# EAGLE board ver5b (EAGLE 6.4), part 1 of 3
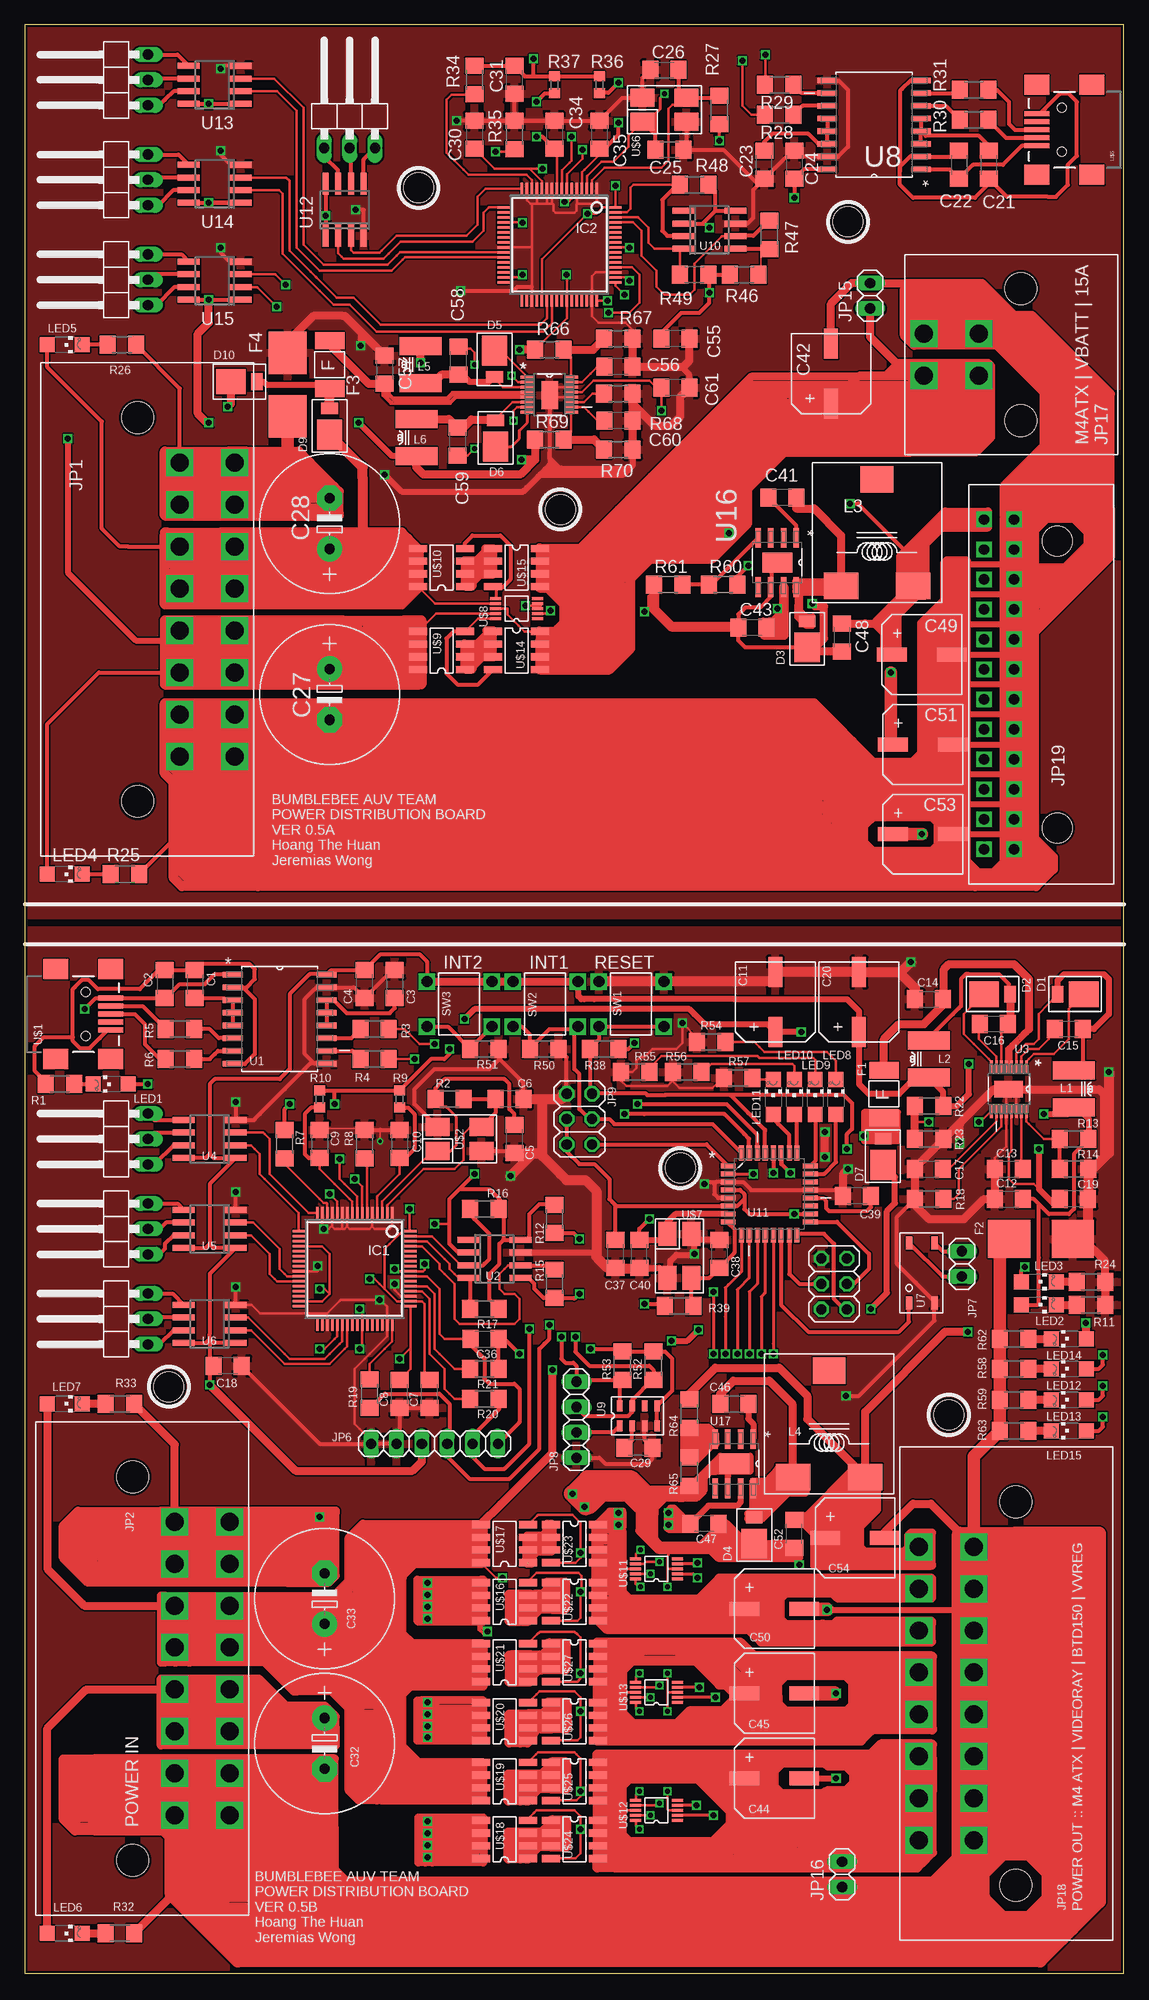
[diagram p7: board, top side]
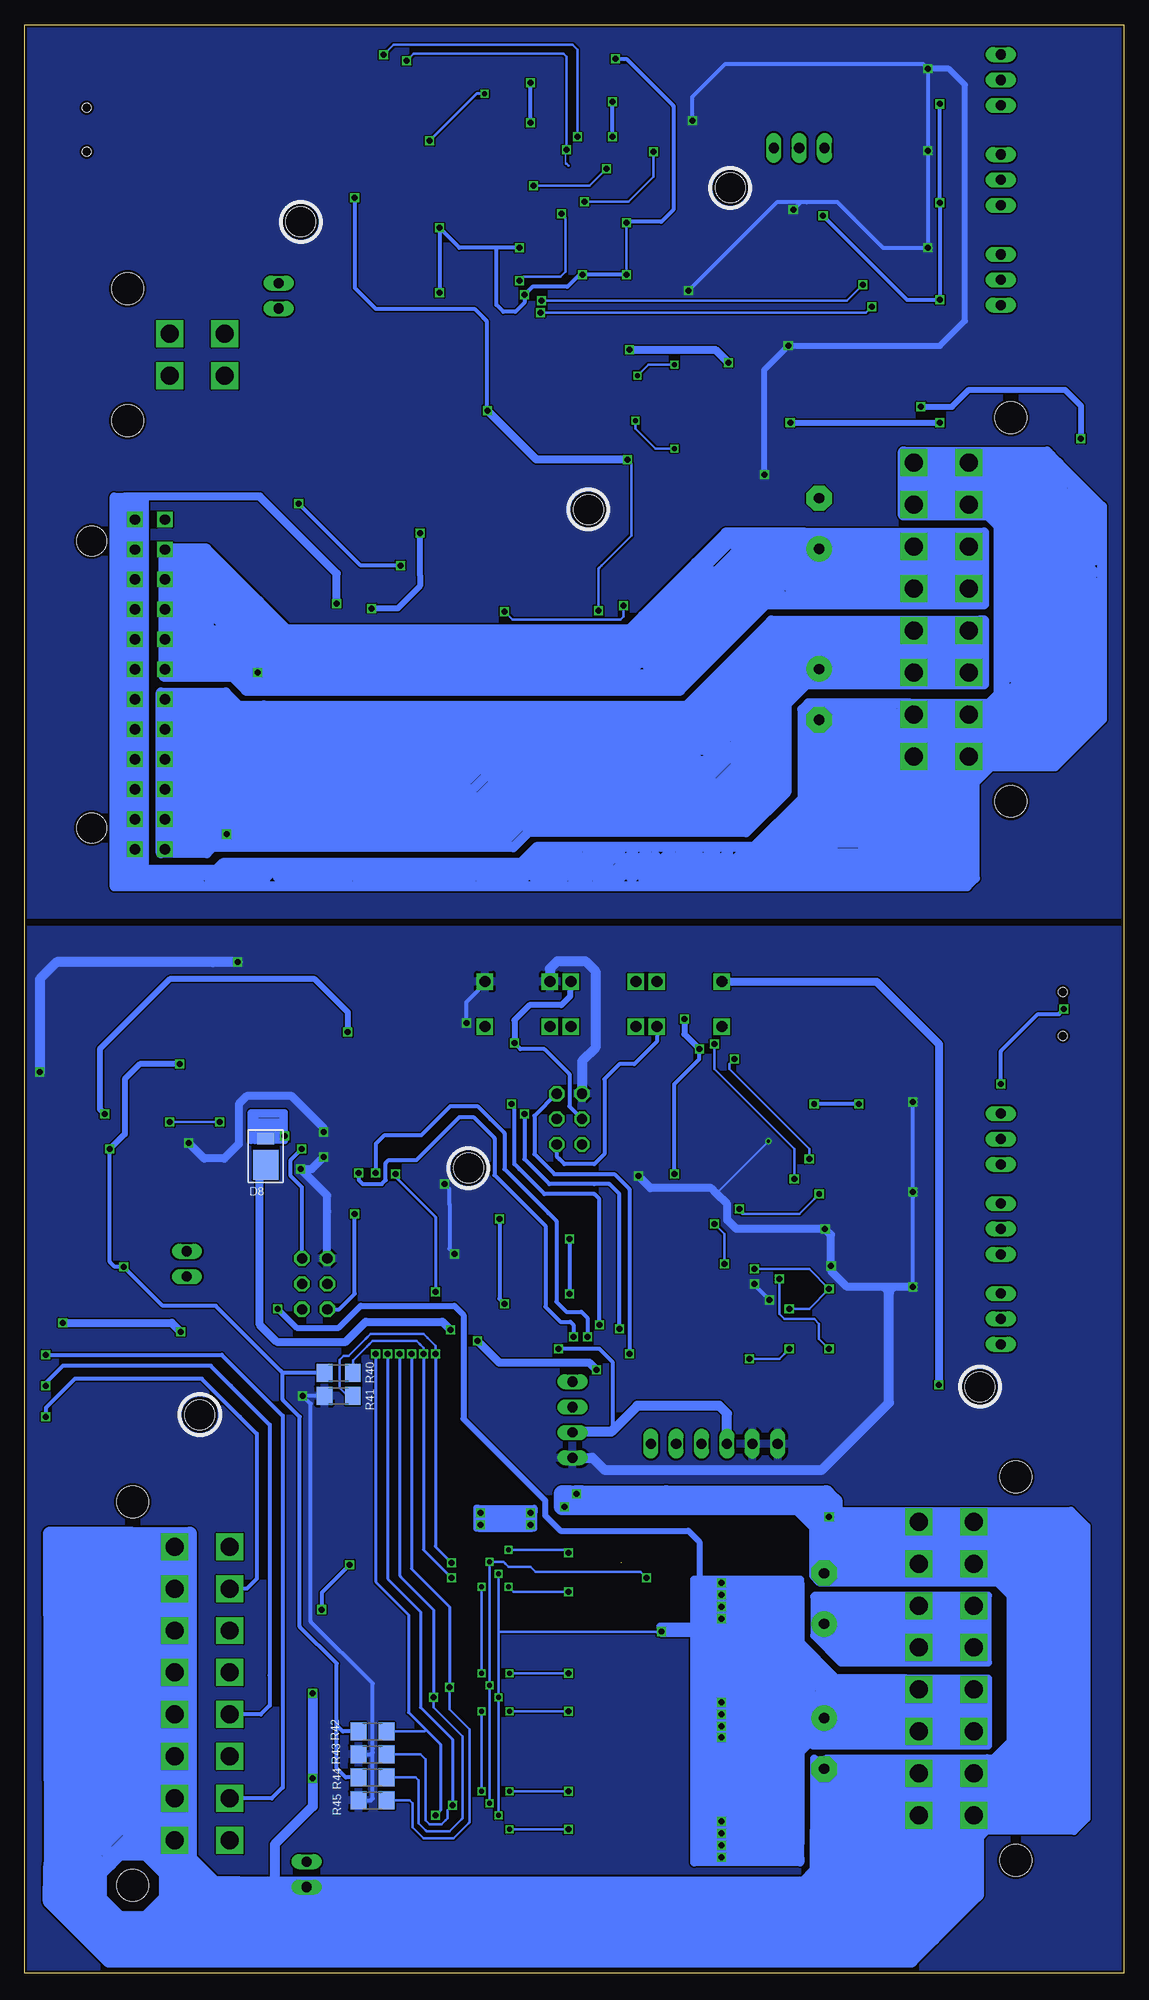
[diagram p8: board, bottom side, seen from below]

Size 110 x 195 mm. Coordinates in mm from the lower left corner, seen from the top.
Outline: 0,0 110,0 110,195 0,195 0,0
Copper layers (1*2*15*16): Top 0.035mm / dielectric 0.2mm / Route2 0.0175mm / dielectric 1.1mm / Route15 0.0175mm / dielectric 0.2mm / Bottom 0.035mm
Design rules "SeeedStudio_DRU_no_angle_20130527": minimum track width 6mil, minimum drill 12mil, track to track 6mil, track to pad 6mil, pad to pad 6mil, via to via 6mil, smd to smd 0mil, copper to edge 10mil, drill to drill 10mil, minimum pad ring 6mil, minimum via ring 6mil, stop-mask expansion 2mil, vias tented up to drill 25mil, thermal gap 10mil
Net classes: 0 default: clearance 0.152 mm
Holes 3 mm at 14.4,58.7 65.6,80.6 92.5,55.9 82.4,175.3 39.4,178.7 53.6,146.5

## Footprints (pad centres in the part's own frame; a part is rotated, then mirrored left to right if it is on the bottom)
C1206 = smd 1.6 x 1.8: 1 -1.4,0; 2 1.4,0
EEEFTH101XAP = smd 3 x 1.4: P$1 -1,0; P$2 5,0
E5-13 = drill 1.016 pad 2.54: + -2.54,0 | drill 1.016 pad 2.54 octagon: - 2.54,0
MBRM140T3G-1459068RL = smd 2.97 x 2.54: 1 0,0 | smd 1.162 x 1.67: 2 2.631,0
MF-MSMF050-2 = smd 1.68 x 2.95: P$1 -2.39,0; P$2 2.39,0
0154.500DR-FUSE-0453.500 = smd 4.24 x 3.81: P$1 -3.19,0; P$2 3.19,0
LQFP64 = smd 0.25 x 1.2: 1 -3.75,-5.6; 2 -3.25,-5.6; 3 -2.75,-5.6; 4 -2.25,-5.6; 5 -1.75,-5.6; 6 -1.25,-5.6; 7 -0.75,-5.6; 8 -0.25,-5.6; 9 0.25,-5.6; 10 0.75,-5.6; 11 1.25,-5.6; 12 1.75,-5.6; 13 2.25,-5.6; 14 2.75,-5.6; 15 3.25,-5.6; 16 3.75,-5.6; 33 3.75,5.6; 34 3.25,5.6; 35 2.75,5.6; 36 2.25,5.6; 37 1.75,5.6; 38 1.25,5.6; 39 0.75,5.6; 40 0.25,5.6; 41 -0.25,5.6; 42 -0.75,5.6; 43 -1.25,5.6; 44 -1.75,5.6; 45 -2.25,5.6; 46 -2.75,5.6; 47 -3.25,5.6; 48 -3.75,5.6 | smd 1.2 x 0.25: 17 5.6,-3.75; 18 5.6,-3.25; 19 5.6,-2.75; 20 5.6,-2.25; 21 5.6,-1.75; 22 5.6,-1.25; 23 5.6,-0.75; 24 5.6,-0.25; 25 5.6,0.25; 26 5.6,0.75; 27 5.6,1.25; 28 5.6,1.75; 29 5.6,2.25; 30 5.6,2.75; 31 5.6,3.25; 32 5.6,3.75; 49 -5.6,3.75; 50 -5.6,3.25; 51 -5.6,2.75; 52 -5.6,2.25; 53 -5.6,1.75; 54 -5.6,1.25; 55 -5.6,0.75; 56 -5.6,0.25; 57 -5.6,-0.25; 58 -5.6,-0.75; 59 -5.6,-1.25; 60 -5.6,-1.75; 61 -5.6,-2.25; 62 -5.6,-2.75; 63 -5.6,-3.25; 64 -5.6,-3.75
39-29-1167-MOLEX = drill 1.8 square: P$1 -14.7,5.5; P$2 -14.7,0; P$3 -10.5,5.5; P$4 -10.5,0; P$5 -6.3,5.5; P$6 -6.3,0; P$7 -2.1,5.5; P$8 -2.1,0; P$9 2.1,5.5; P$10 2.1,0; P$11 6.3,5.5; P$12 6.3,0; P$13 10.5,5.5; P$14 10.5,0; P$15 14.7,5.5; P$16 14.7,0 | hole 3.2: -19.2,-4.2; 19.2,-4.2
1X03/90 = drill 1.016 long: 1 -2.54,-3.81; 2 0,-3.81; 3 2.54,-3.81
1X06 = drill 1.016 long: 1 -6.35,0; 2 -3.81,0; 3 -1.27,0; 4 1.27,0; 5 3.81,0; 6 6.35,0
1X02 = drill 1.016 long: 1 -1.27,0; 2 1.27,0
1X04 = drill 1.016 long: 1 -3.81,0; 2 -1.27,0; 3 1.27,0; 4 3.81,0
2X03 = drill 1.016 octagon: 1 -2.54,-1.27; 2 -2.54,1.27; 3 0,-1.27; 4 0,1.27; 5 2.54,-1.27; 6 2.54,1.27
39-29-4049-MOLEX = drill 1.8 square: P$1 -2.1,5.5; P$2 -2.1,0; P$3 2.1,5.5; P$4 2.1,0 | hole 3.2: -6.6,-4.2; 6.6,-4.2
43045-2400 = drill 1.03 square: 1 0,0; 2 0,3; 3 -3,0; 4 -3,3; 5 -6,0; 6 -6,3; 7 -9,0; 8 -9,3; 9 -12,0; 10 -12,3; 11 -15,0; 12 -15,3; 13 -18,0; 14 -18,3; 15 -21,0; 16 -21,3; 17 -24,0; 18 -24,3; 19 -27,0; 20 -27,3; 21 -30,0; 22 -30,3; 23 -33,0; 24 -33,3 | hole 3: -2.16,-4.32; -30.86,-4.32
LAIRD-TECH-INDUCTOR-TYS5040 = smd 1.8 x 4.2: 1 -1.85,0; 2 1.85,0
SER1360-802KLD-2288814RL-INDUCTOR = smd 2.66 x 3.47: 1 -5.32,3.605; 2 -5.32,-3.605 | smd 2.66 x 3.3: 3 5.32,0
CHIPLED_1206 = smd 1.5 x 1.5: A 0,-1.75; C 0,1.75
R1206 = smd 1.6 x 1.803: 1 -1.422,0; 2 1.422,0
R0603 = smd 1 x 1.1: 1 -0.85,0; 2 0.85,0
MC32829 = drill 1.1 square: P$1 -3.25,-2.25; P$2 -3.25,2.25; P$3 3.25,2.25; P$4 3.25,-2.25
SOIC127P1032X265-16N = smd 1.981 x 0.559: 1 -4.699,4.445; 2 -4.699,3.175; 3 -4.699,1.905; 4 -4.699,0.635; 5 -4.699,-0.635; 6 -4.699,-1.905; 7 -4.699,-3.175; 8 -4.699,-4.445; 9 4.699,-4.445; 10 4.699,-3.175; 11 4.699,-1.905; 12 4.699,-0.635; 13 4.699,0.635; 14 4.699,1.905; 15 4.699,3.175; 16 4.699,4.445
SO08 = smd 0.6 x 2.2: 1 -1.905,-2.6; 2 -0.635,-2.6; 3 0.635,-2.6; 4 1.905,-2.6; 5 1.905,2.6; 6 0.635,2.6; 7 -0.635,2.6; 8 -1.905,2.6
SOP50P490X110-17N = smd 1.397 x 0.279: 1 -2.184,1.753; 2 -2.184,1.245; 3 -2.184,0.762; 4 -2.184,0.254; 5 -2.184,-0.254; 6 -2.184,-0.762; 7 -2.184,-1.245; 8 -2.184,-1.753; 9 2.184,-1.753; 10 2.184,-1.245; 11 2.184,-0.762; 12 2.184,-0.254; 13 2.184,0.254; 14 2.184,0.762; 15 2.184,1.245; 16 2.184,1.753 | smd 1.651 x 2.845: 17 0.025,-0.051
PS2701A-1-F3-A-1682859RL = smd 1.27 x 0.635: P$1 0,0; P$2 0,-2.54; P$3 6,-2.54; P$4 6,0
MPL115A2-OR-MPL115A2T1 = smd 1.1 x 0.55: P$1 -1,1.875; P$2 -1,0.625; P$3 -1,-0.625; P$4 -1,-1.875; P$5 1,-1.875; P$6 1,-0.625; P$7 1,0.625; P$8 1,1.875
QFP80P900X900X120-32N = smd 1.473 x 0.508: 1 -4.115,2.794; 2 -4.115,2.007; 3 -4.115,1.194; 4 -4.115,0.406; 5 -4.115,-0.406; 6 -4.115,-1.194; 7 -4.115,-2.007; 8 -4.115,-2.794; 17 4.115,-2.794; 18 4.115,-2.007; 19 4.115,-1.194; 20 4.115,-0.406; 21 4.115,0.406; 22 4.115,1.194; 23 4.115,2.007; 24 4.115,2.794 | smd 0.508 x 1.473: 9 -2.794,-4.115; 10 -2.007,-4.115; 11 -1.194,-4.115; 12 -0.406,-4.115; 13 0.406,-4.115; 14 1.194,-4.115; 15 2.007,-4.115; 16 2.794,-4.115; 25 2.794,4.115; 26 2.007,4.115; 27 1.194,4.115; 28 0.406,4.115; 29 -0.406,4.115; 30 -1.194,4.115; 31 -2.007,4.115; 32 -2.794,4.115
SOIC127P600X170-9N = smd 1.981 x 0.559: 1 -2.464,1.905; 2 -2.464,0.635; 3 -2.464,-0.635; 4 -2.464,-1.905; 5 2.464,-1.905; 6 2.464,-0.635; 7 2.464,0.635; 8 2.464,1.905 | smd 2.007 x 2.997: 9 0,0
USB-MINIB = smd 2.5 x 0.5: D+ 2.5,0; D- 2.5,0.8; GND 2.5,-1.6; ID 2.5,-0.8; VBUS 2.5,1.6 | smd 2.5 x 2: MTN1 -3,4.5; MTN2 2.5,4.5; MTN3 -3,-4.5; MTN4 2.5,-4.5 | hole 0.9: 0,2.2; 0,-2.2
ABMM2-16.000MHZ-E2-T = smd 2.4 x 1.8: P$1 -2.2,-1.2; P$2 2.2,-1.2; P$3 2.2,1.2; P$4 -2.2,1.2
LTC4416 = smd 0.305 x 1.1: P$1 -1,-2.095; P$2 -0.5,-2.095; P$3 0,-2.095; P$4 0.5,-2.095; P$5 1,-2.095; P$6 1,2.095; P$7 0.5,2.095; P$8 0,2.095; P$9 -0.5,2.095; P$10 -1,2.095
IRF9310PBF = smd 0.72 x 1.8: P$1 -1.905,-2.34; P$2 -0.635,-2.34; P$3 0.635,-2.34; P$4 1.905,-2.34; P$5 1.905,2.34; P$6 0.635,2.34; P$7 -0.635,2.34; P$8 -1.905,2.34

## Placement (x,y rotation side)
C1  0.5uF  [C1206]  17,99 270 top
C2  0.5uF  [C1206]  14,99 270 top
C3  0.5uF  [C1206]  37,99 270 top
C4  0.5uF  [C1206]  34,99 90 top
C5  22pF  [C1206]  49,83.5 90 top
C6  22pF  [C1206]  48.5,87.5 180 top
C7  10uF  [C1206]  40.5,58 90 top
C8  10uF  [C1206]  37.5,58 90 top
C9  10uF  [C1206]  29.5,83 270 top
C10  10uF  [C1206]  37.5,83 270 top
C11  [EEEFTH101XAP]  75.1,95.2 90 top
C12  10uF  [C1206]  98.5,77.5 0 top
C13  1nF  [C1206]  98.5,80.5 0 top
C14  2.2uF  [C1206]  90.5,97.5 0 top
C15  0.1uF  [C1206]  104.5,94.5 180 top
C16  0.1uF  [C1206]  97,95 180 top
C17  1nF  [C1206]  90.5,80.5 0 top
C18  0.5uF  [C1206]  20.3,60.8 180 top
C19  22uF  [C1206]  105,77.5 180 top
C20  [EEEFTH101XAP]  83.5,95.2 90 top
C21  0.5uF  [C1206]  96.5,181 90 top
C22  0.5uF  [C1206]  93.5,181 270 top
C23  0.5uF  [C1206]  74,181 90 top
C24  0.5uF  [C1206]  77,181 270 top
C25  22pF  [C1206]  64.5,182.5 180 top
C26  22pF  [C1206]  64,190.5 0 top
C27  UVY2A221MHD1TO  [E5-13]  30.5,128 270 top
C28  UVY2A221MHD1TO  [E5-13]  30.5,145.1 90 top
C29  [C1206]  61.4,52.6 180 top
C30  10uF  [C1206]  45,184 270 top
C31  10uF  [C1206]  49,189.5 90 top
C32  UVY2A221MHD1TO  [E5-13]  30,23 270 top
C33  UVY2A221MHD1TO  [E5-13]  30,37.5 90 top
C34  10uF  [C1206]  53,184 270 top
C35  10uF  [C1206]  57.5,184 270 top
C36  [C1206]  46,63.5 0 top
C37  22pF  [C1206]  61.5,72 90 top
C38  22pF  [C1206]  69.5,72 270 top
C39  22pF  [C1206]  83.3,77.8 180 top
C40  0.5uF  [C1206]  59.1,72 270 top
C41  [C1206]  75.8,147.7 180 top
C42  [EEEFTH101XAP]  80.7,158.1 90 top
C43  [C1206]  72.8,134.7 0 top
C44  [EEEFTH101XAP]  73,19.5 0 top
C45  [EEEFTH101XAP]  73,28 0 top
C46  [C1206]  71,57 0 top
C47  [C1206]  68,45 180 top
C48  [C1206]  81.8,133.7 90 top
C49  [EEEFTH101XAP]  87.8,132 0 top
C50  [EEEFTH101XAP]  73,36.5 0 top
C51  [EEEFTH101XAP]  87.9,123 0 top
C52  [C1206]  77,44 90 top
C53  [EEEFTH101XAP]  87.9,114 0 top
C54  [EEEFTH101XAP]  81.1,43.6 0 top
C55  10uF X7R  [C1206]  65.1,163.6 180 top
C56  1nF X7R  [C1206]  59.4,160.8 180 top
C57  2.2uF X7R  [C1206]  36,160.5 270 top
C58  0.1uF X7R  [C1206]  43.4,161.4 90 top
C59  0.1uF X7R  [C1206]  43.3,153.3 270 top
C60  1nF X7R  [C1206]  59.4,155.4 180 top
C61  22uF X7R  [C1206]  65.1,158.7 180 top
D1  MBRM140T3G-1459068RL  [MBRM140T3G-1459068RL]  106,98 180 top
D2  MBRM140T3G-1459068RL  [MBRM140T3G-1459068RL]  96,98 0 top
D3  MBRM140T3G-1459068RL  [MBRM140T3G-1459068RL]  78.3,132.7 90 top
D4  MBRM140T3G-1459068RL  [MBRM140T3G-1459068RL]  73,43 90 top
D5  MBRM140T3G-1459068RL  [MBRM140T3G-1459068RL]  47,162.4 270 top
D6  MBRM140T3G-1459068RL  [MBRM140T3G-1459068RL]  47.1,152.8 90 top
D7  MBRM140T3G-1459068RL  [MBRM140T3G-1459068RL]  85.9,80.9 90 top
D8  MBRM140T3G-1459068RL  [MBRM140T3G-1459068RL]  85.9,80.9 90 bottom
D9  MBRM140T3G-1459068RL  [MBRM140T3G-1459068RL]  30.5,154 90 top
D10  MBRM140T3G-1459068RL  [MBRM140T3G-1459068RL]  20.6,159.3 0 top
F1  500mA  [MF-MSMF050-2]  86,88 90 top
F2  [0154.500DR-FUSE-0453.500]  101.7,73.5 0 top
F3  500mA  [MF-MSMF050-2]  30.5,161 90 top
F4  [0154.500DR-FUSE-0453.500]  26.3,159 90 top
IC1  FT4232HL  [LQFP64]  33,70.5 180 top
IC2  FT4232HL  [LQFP64]  53.5,173 180 top
JP1  [39-29-1167-MOLEX]  15.5,136.5 270 top
JP2  POWER IN  [39-29-1167-MOLEX]  15,30.5 270 top
JP3  SERIAL_1  [1X03/90]  8.5,83.5 90 top
JP4  SERIAL_2  [1X03/90]  8.5,74.5 90 top
JP5  SERIAL_3  [1X03/90]  8.5,65.5 90 top
JP6  HWSERIAL  [1X06]  41,53 0 top
JP7  SBC_SW  [1X02]  93.8,71 90 top
JP8  I2C  [1X04]  55.2,55.4 90 top
JP9  [2X03]  55.5,85.5 270 top
JP10  ISCP  [2X03]  81,69 90 top
JP11  SERIAL_1  [1X03/90]  32.5,186.5 0 top
JP12  SERIAL_2  [1X03/90]  8.5,189.5 90 top
JP13  SERIAL_3  [1X03/90]  8.5,179.5 90 top
JP14  SERIAL_4  [1X03/90]  8.5,169.5 90 top
JP15  DC FAN 24V  [1X02]  84.6,167.9 90 top
JP16  DC FAN 24V  [1X02]  81.8,9.9 90 top
JP17  M4ATX | VBATT | 15A  [39-29-4049-MOLEX]  95.5,162 90 top
JP18  POWER OUT :: M4 ATX | VIDEORAY | BTD150 | VVREG  [39-29-1167-MOLEX]  95,28 90 top
JP19  [43045-2400]  99,145.5 90 top
L1  6.8uH 2292530  [LAIRD-TECH-INDUCTOR-TYS5040]  105,88.5 90 top
L2  10uH 2292532  [LAIRD-TECH-INDUCTOR-TYS5040]  90.5,91.5 270 top
L3  [SER1360-802KLD-2288814RL-INDUCTOR]  85.3,144.2 90 top
L4  [SER1360-802KLD-2288814RL-INDUCTOR]  80.5,55 90 top
L5  6.8uH 2292530  [LAIRD-TECH-INDUCTOR-TYS5040]  39.6,161 270 top
L6  10uH 2292532  [LAIRD-TECH-INDUCTOR-TYS5040]  39.2,153.7 270 top
LED1  [CHIPLED_1206]  8.6,89 90 top
LED2  [CHIPLED_1206]  101.5,66.9 270 top
LED3  [CHIPLED_1206]  101.5,69.2 270 top
LED4  [CHIPLED_1206]  4,110 270 top
LED5  [CHIPLED_1206]  4,163 270 top
LED6  [CHIPLED_1206]  4,4 270 top
LED7  [CHIPLED_1206]  4,57 270 top
LED8  [CHIPLED_1206]  81.2,87.7 0 top
LED9  [CHIPLED_1206]  79.1,87.7 0 top
LED10  [CHIPLED_1206]  77,87.7 0 top
LED11  [CHIPLED_1206]  74.9,87.7 0 top
LED12  [CHIPLED_1206]  104.5,60.5 90 top
LED13  [CHIPLED_1206]  104.5,57.4 90 top
LED14  [CHIPLED_1206]  104.5,63.5 90 top
LED15  [CHIPLED_1206]  104.5,54.3 90 top
R1  300  [R1206]  3.5,89 0 top
R2  1M  [R1206]  42.5,87.5 0 top
R3  24  [R1206]  35,94.5 0 top
R4  24  [R1206]  35,91.5 0 top
R5  24  [R1206]  15.5,94.5 180 top
R6  24  [R1206]  15.5,91.5 180 top
R7  1k  [R1206]  26,83 270 top
R8  12k  [R1206]  34,83 270 top
R9  INDUCTOR-AISC-0603-R0082-J-T-1628488  [R0603]  37.5,87.5 270 top
R10  INDUCTOR-AISC-0603-R0082-J-T-1628488  [R0603]  29.5,87.5 270 top
R11  100  [R1206]  106.7,66.9 180 top
R12  10k  [R1206]  53,75.5 270 top
R13  31.6k  [R1206]  105,83.5 180 top
R14  10.2k  [R1206]  105,80.5 0 top
R15  10k  [R1206]  53,69 270 top
R16  10k  [R1206]  46,76.5 180 top
R17  10k  [R1206]  46,66.5 180 top
R18  60.4k  [R1206]  90.5,77.5 180 top
R19  1k  [R1206]  34.5,58 90 top
R20  1k  [R1206]  46,57.5 180 top
R21  100  [R1206]  46,60.5 180 top
R22  53.6k  [R1206]  90.5,86.8 180 top
R23  10.2k  [R1206]  90.5,83.5 0 top
R24  300  [R1206]  106.7,69.2 180 top
R25  5000  [R1206]  10,110 180 top
R26  5000  [R1206]  9.7,163 180 top
R27  1M  [R1206]  69.5,186.5 90 top
R28  24  [R1206]  75.5,186 180 top
R29  24  [R1206]  75.5,189 180 top
R30  24  [R1206]  95,185.5 0 top
R31  24  [R1206]  95,188.5 0 top
R32  5000  [R1206]  9.5,4 180 top
R33  5000  [R1206]  9.5,57 180 top
R34  1k  [R1206]  45,189.5 270 top
R35  12k  [R1206]  49,184 270 top
R36  INDUCTOR-AISC-0603-R0082-J-T-1628488  [R0603]  57.5,189 270 top
R37  INDUCTOR-AISC-0603-R0082-J-T-1628488  [R0603]  53,189 270 top
R38  100  [R1206]  58,92.5 0 top
R39  1M  [R1206]  65.5,66.8 0 top
R40  10k  [R1206]  78.6,60.1 0 bottom
R41  10k  [R1206]  78.6,57.8 0 bottom
R42  10k  [R1206]  75.2,24.2 0 bottom
R43  10k  [R1206]  75.2,21.9 0 bottom
R44  10k  [R1206]  75.2,19.6 0 bottom
R45  10k  [R1206]  75.2,17.3 0 bottom
R46  10k  [R1206]  72,170 0 top
R47  10k  [R1206]  74.5,174 270 top
R48  10k  [R1206]  67,179 180 top
R49  10k  [R1206]  67,170 180 top
R50  100  [R1206]  52,92.5 0 top
R51  100  [R1206]  46,92.5 0 top
R52  1k8  [R1206]  62.9,60.8 90 top
R53  1k8  [R1206]  59.8,60.8 90 top
R54  300  [R1206]  68.7,93.2 0 top
R55  300  [R1206]  61.1,90.2 0 top
R56  300  [R1206]  66.3,90.2 0 top
R57  300  [R1206]  71.4,89.6 0 top
R58  5000  [R1206]  99,60.5 0 top
R59  5000  [R1206]  99,57.4 0 top
R60  [R1206]  69.9,139 0 top
R61  [R1206]  64.4,139 0 top
R62  5000  [R1206]  99,63.5 180 top
R63  5000  [R1206]  99,54.3 180 top
R64  [R1206]  66.5,56 90 top
R65  [R1206]  66.5,50.2 90 top
R66  31.6k  [R1206]  52.5,162.5 0 top
R67  10.2k  [R1206]  59.4,163.6 0 top
R68  60.4k  [R1206]  59.4,158.1 0 top
R69  53.6k  [R1206]  52.5,153.5 0 top
R70  10.2k  [R1206]  59.4,152.5 0 top
SW1  RESET  [MC32829]  60.7,97 180 top
SW2  INT1  [MC32829]  52.1,97 180 top
SW3  INT2  [MC32829]  43.5,97 180 top
U1  ADUM3160BRWZ  [SOIC127P1032X265-16N]  25.5,95.5 0 top
U2  CAT93C46WI-GT3-1718152-EEPROM  [SO08]  47,71.5 270 top
U3  LT3509EMSEPBF  [SOP50P490X110-17N]  98.5,88.5 270 top
U4  ISO7221ADR-1575146  [SO08]  18.5,83.5 90 top
U5  ISO7221ADR-1575146  [SO08]  18.5,74.5 90 top
U6  ISO7221ADR-1575146  [SO08]  18.5,65 90 top
U7  PS2701A-1-F3-A-1682859RL  [PS2701A-1-F3-A-1682859RL]  88.5,67.1 90 top
U8  ADUM3160BRWZ  [SOIC127P1032X265-16N]  85,185 180 top
U9  MPL115A2-OR-MPL115A2T1  [MPL115A2-OR-MPL115A2T1]  61.4,55.8 90 top
U10  CAT93C46WI-GT3-1718152-EEPROM  [SO08]  68.5,174.5 270 top
U11  ATMEGA328P-AU  [QFP80P900X900X120-32N]  74.5,78 0 top
U12  ISO7221ADR-1575146  [SO08]  32,176.5 0 top
U13  ISO7221ADR-1575146  [SO08]  19,189 90 top
U14  ISO7221ADR-1575146  [SO08]  19,179.1 90 top
U15  ISO7221ADR-1575146  [SO08]  19,169.4 90 top
U16  TPS5450DDARG4  [SOIC127P600X170-9N]  75.3,141.2 270 top
U17  TPS5450DDARG4  [SOIC127P600X170-9N]  71,51 270 top
U18  LT3509EMSEPBF  [SOP50P490X110-17N]  52.5,158 0 top
U$1  USB-MINIB-5PIN  [USB-MINIB]  6.1,96 0 top
U$2  ABMM2-12.000MHZ-E2-T  [ABMM2-16.000MHZ-E2-T]  43.5,83.5 0 top
U$5  USB-MINIB-5PIN  [USB-MINIB]  103.8,184.5 180 top
U$6  ABMM2-12.000MHZ-E2-T  [ABMM2-16.000MHZ-E2-T]  64,186.5 0 top
U$7  ABMM2-16.000MHZ-E2-T  [ABMM2-16.000MHZ-E2-T]  65.5,71.8 270 top
U$8  LTC4416  [LTC4416]  49.2,136.6 90 top
U$9  IRF9310PBF  [IRF9310PBF]  41.7,132.4 90 top
U$10  IRF9310PBF  [IRF9310PBF]  41.7,140.7 90 top
U$11  LTC4416  [LTC4416]  63.2,40.5 90 top
U$12  LTC4416  [LTC4416]  63.2,16.3 90 top
U$13  LTC4416  [LTC4416]  63.2,28.1 90 top
U$14  IRF9310PBF  [IRF9310PBF]  49.2,132.4 270 top
U$15  IRF9310PBF  [IRF9310PBF]  49.2,140.7 270 top
U$16  IRF9310PBF  [IRF9310PBF]  48,37.2 90 top
U$17  IRF9310PBF  [IRF9310PBF]  48,43 90 top
U$18  IRF9310PBF  [IRF9310PBF]  48,13.4 90 top
U$19  IRF9310PBF  [IRF9310PBF]  48,19.2 90 top
U$20  IRF9310PBF  [IRF9310PBF]  48,25.2 90 top
U$21  IRF9310PBF  [IRF9310PBF]  48,31.1 90 top
U$22  IRF9310PBF  [IRF9310PBF]  55,37.2 270 top
U$23  IRF9310PBF  [IRF9310PBF]  55,43 270 top
U$24  IRF9310PBF  [IRF9310PBF]  55,13.4 270 top
U$25  IRF9310PBF  [IRF9310PBF]  55,19.2 270 top
U$26  IRF9310PBF  [IRF9310PBF]  55,25.2 270 top
U$27  IRF9310PBF  [IRF9310PBF]  55,31.1 270 top

## Tracks (layer width: path | path; a pad name or v marks a point on that pad's centre or on a via)
+1.8_A  (via drill 0.6)
  Top 0.254: C7.2 40,59.9 40,67 39.75,67.25 IC1.50 37.25,67.25 36,68.5 | IC1.12 31.25,77.25 v30.5,78 | 36,68.5 36,72.5 36.5,73 37.5,74 37.75,74.25 IC1.64 38.5,74.35 v38.5,76.5 | 36,68.5 35.5,69 35,69.5 v34.5,69.5 | v29.5,62.5 30,62.5 31,63.5 31.25,63.75 IC1.37
  Bottom 0.254: v30.5,78 31,77.5 32.5,76 38.2,76 38.5,76.3 v38.5,76.5 | v34.5,69.5 34.5,66 34,65.5 31,65.5 30.5,65 30.5,63.5 v29.5,62.5
+1.8_B  (via drill 0.6)
  Top 0.254: C30.2 47,180.6 50.3,180.6 50.4,180.6 | 50.4,180.6 50.5,180.6 51.75,179.35 IC2.12 | IC2.50 60.15,169.75 v60.5,169.4 | v59.1,178.9 IC2.64 57.85,176.75 57.8,176.7 57.2,176.1 v56.3,176.1 51.75,171.55 IC2.37 | v51.8,180.6 50.4,180.6
  Bottom 0.254: v60.5,169.4 60.1,169.8 56.4,169.8 55.9,170.3 55.9,175.7 v56.3,176.1 | v59.1,178.9 53.5,178.9 v51.8,180.6
+3.3_A  (via drill 0.6)
  Top 0.254: IC1.20 29.75,72.75 30.5,72 30.5,68 | IC1.31 29.75,67.25 30.5,68 | C8.2 38.6,60.5 IC1.49 38.6,62.6 v37.5,61.5 | v41,75 42.5,75 | v37,70.5 37.25,70.25 IC1.56 39.25,70.25 39.85,70.25 40,70.4 v40,71 | v29.5,68.5 30,68.5 30.5,68 | v33.5,66.5 33.75,66.25 IC1.42 33.75,62.75 v33.5,62.5
  Top 0.406: R10.1 31,88.35 | 31,88.35 31.5,88.35 R9.1 40.65,91.5 42,91.5 42.5,92 v42.5,92.5 | R7.1 26,86.5 v26.5,87 | R17.1 46.5,67.42 46.5,68.5 46.5,70 47.5,71 47.5,73 47.91,73.41 | 47.91,73.41 U2.8 50.48,73.41 50.48,75.98 51.5,77 52.92,77 R12.1 | 47.91,73.41 47.91,76.02 R16.1 47.5,76.58 47.5,77.5 46.5,78.5 43.5,78.5 | U2.2 43.37,72.14 42.5,73 42.5,75 42.5,77.5 43.5,78.5 | v31,87 31,88.35 | 43.5,78.5 v45,80 | L1.1 105.35,86.65 | 106.5,83.58 R13.1 106.42,83.42 105,82 105,76.5 104.5,76 102.5,76 102,76.5 101.5,77 | 101.5,77 101,77.5 C12.2 | LED2.A 101.4,66.9 101.5,67 101.5,71.6 101.5,77
  Top 0.61: v44,95.5 45,96.5 66.5,96.5 67,96 68,95 73,95 74.3,95 C11.P$1 v77.7,94.2 | v102,86 104.35,86 L1.1 | 105.35,86.65 106.5,85.5 106.5,83.58 R13.1
  Bottom 0.254: v40,71 40,74 v41,75 | v37,70.5 31.5,70.5 v29.5,68.5 31.5,66.5 v33.5,66.5 | v37.5,61.5 34.5,61.5 34,62 | 34,62 v33.5,62.5 34,62
  Bottom 0.406: v26.5,87 v31,87 | v45,80 45,88.5 45,89 43.5,90.5 43,91 42.5,91.5 v42.5,92.5
  Bottom 0.61: v44,95.5 44,94 v42.5,92.5 | v102,86 102.5,86.5 102.5,92.5 95.5,99.5 81,99.5 79,97.5 78,96.5 77.7,96.2 77.7,94.7 v77.7,94.2
+3.3_B  (via drill 0.6)
  Top 0.152: 63.5,163.29 C55.2 | 68.58,168.37 v68.5,168.2
  Top 0.254: R66.1 54.25,165.67 IC2.42 54.25,169.95 v54.2,170 54.3,169.9 | IC2.31 49.55,169.75 v49.8,170 | IC2.20 49.75,175.25 v49.8,175.2 | 50.05,189.85 50.95,189.85 51,189.8 | IC2.49 59.1,168.9 v60,168 | IC2.56 60.45,172.75 v60.5,172.7
  Top 0.305: 51,189.8 51,189.9 50.9,190
  Top 0.406: R34.1 45.02,190.9 C31.2 50.05,189.85 R37.1 R36.1 | 50.9,190 v50.9,191.6 | U10.2 67.83,175.13 | 67.83,175.13 69.1,176.4 | 69.1,176.4 U10.8 | 69.1,176.4 69.1,178.32 R48.1 | 67.83,175.13 68.06,175.13 v68.5,174.7 | R46.1 R49.1 68.5,169.92 v68.5,168.2 68.5,167.2 67.5,166.2 65.7,166.2 63.5,164 63.5,163.29
  Top 0.813: R66.1 v49.5,162.5 | v39.6,161.2 L5.1
  Bottom 0.254: v49.8,170 49.8,174.4 | 49.8,174.4 v49.8,175.2 49.8,174.4
  Bottom 0.406: v50.9,191.6 49.8,191.6 45.1,186.9 45.1,176.5 46.3,175.3 49.7,175.3 v49.8,175.2 | v49.8,170 v54.2,170 54.5,170 55.7,168.8 59.2,168.8 v60,168 60,167.2 60.9,166.3 62.1,166.3 62.8,167 62.8,172.7 | v68.5,168.2 68.5,168.5 v68.5,174.7 66.5,172.7 62.8,172.7 | v60.5,172.7 62.8,172.7
  Bottom 0.813: v49.5,162.5 40.9,162.5 v39.6,161.2
+5V_A  (via drill 0.6)
  Top 0.254: C19.2 102.5,77.5 101,79 99,79 98.5,79.5 98.5,82 98.75,82.25 U3.13
  Top 0.406: 18.5,82 18.5,89 19,89.5 25.5,89.5 26.5,90.5 26.5,98 28.5,100 30.14,100 U1.16 30.65,100.4 C4.2 35.6,102 36,102 39.5,102 40.25,101.25 SW3.P$4 | 18.5,82 18.09,81.59 U4.8 | 18.5,82 18.91,81.59 U4.1 18.5,79 18.5,73.5 18.5,73 | U5.8 18.09,72.59 18.5,73 | 18.5,73 18.91,72.59 U5.1 18.5,70 18.5,64 18.5,63.6 | U6.8 18.09,63.09 18.5,63.5 | 18.5,63.5 18.5,63.6 | U6.1 18.91,63.09 18.5,63.5 | JP9.3 JP9.5 54.23,82.27 55.5,81 57,81 58.5,79.5 58.5,77.5 58.8,77.2 | U11.18 v77,76 72.5,76 72,76.5 72,77.5 | 71.59,78.41 U11.4 71.59,78.41 | 71.59,78.41 72,78 | 72,78 72,77.5 | 72,77.5 71.5,77 | 71.5,77 71.31,76.81 U11.6 59.19,76.81 59,77 58.8,77.2 | 71.59,78.41 72,78 | 72,78 72,77.5 | 72,77.5 71.5,77 | U9.P$4 U9.P$5 64.8,58.33 64.8,59.4 64.8,61.5 64.1,62.2 62.92,62.2 R52.2 R53.2 59.52,62.5 v56.6,62.5 | C18.2 18.5,60.4 v18.5,58.9 | 18.5,63.5 18.5,61.2 | 18.5,63.5 18.5,63.6 | U9.P$1 58.85,54.13 JP8.2 | R38.2 60.4,92.5 v61,93.1 | LED3.A 99.75,70.35 100,70.6 v100.1,70.7 | C40.1 59.1,76.9 58.8,77.2 | 55.1,99.2 SW2.P$1 | 55.1,99.2 SW2.P$1 | 55.1,99.2 SW2.P$1 | 55.1,99.2 SW2.P$1 | 55.1,99.2 SW2.P$1
  Top 0.61: 57,97.5 56,97.5 | v94.5,91 94.5,88 93.3,86.8 R22.1 91.92,88.23 L2.2 89.15,89.65 87.5,88 84.5,88 83.5,89 C20.P$1 83.5,96.3 82.3,97.5 71,97.5 57,97.5 | v101.5,82.5 101.5,78.5 103,77 103.1,77 C19.2 | 57,97.5 56,97.5 | 56,97.5 55.7,97.5 55.4,97.8 55.4,99.2 SW2.P$1
  Top 0.813: v18.5,58.9 27.1,50.3 38.8,50.3 39.73,51.23 JP6.3 | SW3.P$4 SW3.P$1 SW2.P$4 SW2.P$1
  Bottom 0.406: JP9.3 55.5,86.77 55.5,90 58,92.5 60.4,92.5 v61,93.1 | JP10.2 78.54,66.46 77.5,67.5 77,68 v77,76 | 51.05,54.45 51.2,54.6 51.2,61.2 52.5,62.5 v56.6,62.5 | v101.5,82.5 101.5,71.2 101,70.7 v100.1,70.7 96.2,66.8 90.9,66.8 84.4,60.3 | R40.1 84.2,60.1 | 84.2,60.1 84.4,60.3 | 78.2,24.2 R42.1 78.2,24.2 | 78.2,24.2 78.8,24.8 | R44.1 77.9,19.6 78.8,20.5 78.8,24.8 | 78.2,24.2 78.8,24.8 | 78.8,24.8 78.8,31 82.5,34.7 82.5,55.7 84.2,57.4 84.2,60.1 | 84.2,60.1 84.4,60.3
  Bottom 0.61: v94.5,91 98.5,91 100,89.5 100,84 v101.5,82.5 | v61,93.1 61,95.4 59.5,96.9 56.3,96.9 55.4,97.8 55.4,99.2 SW2.P$1
  Bottom 0.813: SW3.P$4 24.75,99.25 18.5,93 v18.5,58.9
  Bottom 1.016: JP6.3 39.73,56.03 40.5,56.8 48.7,56.8 51.05,54.45 51.3,54.2 55.13,54.2 JP8.2
+5V_B  (via drill 0.6)
  Top 0.254: U18.13 55.75,158.25 56.9,159.4 62.5,159.4 63.7,158.2 v63.7,156.4 C61.2 | R69.1 51.08,151.68 50.9,151.5 | U$8.P$2 52.2,136.1 52.6,136.1 v52.6,136.4
  Top 0.406: U13.8 v18.4,187.09 | v18.4,187.09 19.2,187.09 | 19.2,187.09 U13.1 | U14.8 U14.1 | U15.8 v18.4,167.5 | v18.4,167.5 18.9,167.5 | 18.9,167.5 U15.1 | U14.1 v18.41,177.19 | v18.41,177.19 v18.4,177.2 v18.41,177.19 | v18.4,187.09 19.2,187.09 | U14.1 v18.41,177.19 | v18.4,167.5 18.9,167.5 | U12.1 U12.8 v30.1,175.9 | U8.16 77.95,180.56 C24.2 v77,177.7
  Top 0.61: L6.2 36.75,151.85 v33.4,155.2
  Top 0.813: R69.1 51.08,151.48 49.6,150 39.9,150 39.2,150.7 L6.2 | 50.9,151.5 v49.7,151.5 | v18.4,155.2 18.2,155.2 17.3,156.1 17.3,164.1 18.4,165.2 v18.4,167.5
  Bottom 0.254: v49.7,151.5 49.3,151.1 49.3,143.9 52.3,140.9 52.5,140.7 52.6,140.6 v52.6,136.4
  Bottom 0.406: v18.4,187.09 v18.4,177.2 v18.4,167.5 21.7,167.5 v30.1,175.9 | v77,177.7 77,168.7 74.9,166.6 65,166.6 64.1,165.7 63.9,165.5 63.8,165.4 63.8,156.5 v63.7,156.4
  Bottom 0.61: v33.4,155.2 v18.4,155.2
  Bottom 0.813: v49.7,151.5 58.8,151.5 v63.7,156.4
A0
  Top 0.406: U11.23 80.01,80.01 81.2,81.2 LED8.A
A1
  Top 0.406: LED9.A 79.1,81.28 U11.24
A2
  Top 0.406: U11.25 77.29,85.66 LED10.A
A3
  Top 0.406: U11.26 76.51,83.89 75.4,85 74.9,85.5 LED11.A
A4/SDA  (via drill 0.6)
  Top 0.406: JP8.3 56.07,55.8 60.4,55.8 60.77,56.17 U9.P$7 60.8,56.83 60.8,57.4 62.78,59.38 R52.1 62.9,60.4 62.5,60.8 56.5,60.8 56,61.3 55.1,62.2 v55.1,63.7 | 75.7,81.1 75.7,82.2 75.7,81.1 | 75.7,81.1 75.7,81 76.3,80.4 76.5,80.2 v76.6,80.1 | 75.7,81.1 U11.27
  Bottom 0.406: v55.1,63.7 55.1,64.9 55.4,65.2 56.4,65.2 57.9,66.7 57.9,74.8 63,79.9 63,83.6 65.1,85.7 66.5,85.7 70,82.2 70.8,81.4 73.6,81.4 73.9,81.1 73.9,79.4 74.3,79 76.2,79 76.6,79.4 v76.6,80.1
A5/SCL  (via drill 0.6)
  Top 0.406: U9.P$8 59.52,59.1 R53.1 55.37,59.38 JP8.4 55.2,60.8 54.9,61.1 54.1,61.1 53.7,61.5 v53.7,63.7 | U11.28 v74.91,80.11 v74.9,80.1
  Bottom 0.406: v53.7,63.7 53.7,65.6 54.3,66.2 55.8,66.2 56.8,67.2 56.8,75.3 57.6,76.1 62,80.5 62,84.1 63.4,85.5 64.7,86.8 67.4,86.8 70.3,83.9 74,83.9 74.9,83 v74.9,80.1
D0/RXI  (via drill 0.6)
  Top 0.406: R19.1 34.58,56.58 36,58 41.5,58 42.5,57 42.5,53.23 JP6.4 42.27,51.73 44,50 44.5,49.5 48.5,49.5 51.5,52.5 51.5,62.5 52,63 52.5,63.5 v52.5,64.9 | U11.30 73.31,83.89 70.2,87 v61.3,87
  Bottom 0.406: v52.5,64.9 52.5,77.5 53,78 58,78 60.5,80.5 61,81 61,85 61,86.7 v61.3,87
D1/TXO  (via drill 0.6)
  Top 0.406: JP6.5 44.81,53.81 45,54 | 45,54 47.5,56.5 47.5,57.42 R20.1 47.42,56.42 45,54 | 45,54 45,51.5 45.5,51 46,50.5 48,50.5 50.5,53 v50.5,64.5 | U11.31 72.49,83.51 72,84 70,86 62,86 v60,86
  Bottom 0.406: v50.5,64.5 50.5,78 51.5,79 53,79 57.5,79 60,81.5 v60,86
D2
  Top 0.406: SW2.P$3 49.75,94.75 50.5,94 50.5,92.58 R50.1 50.58,92.58 52.5,94.5 55,94.5 | 55,94.5 SW2.P$2 55,94.5 | 55,94.5 55,90.5 55.5,90 55.5,86.5 56.5,85.5 JP9.4 58.5,85.5 59,85 68.82,85 U11.32
D3
  Top 0.406: SW3.P$3 42.33,94.75 R51.1 44.58,92.58 SW3.P$2 | JP9.6 68.22,82.96 U11.1
  Bottom 0.406: SW3.P$2 46.75,93.25 49,91 50.5,91 52,89.5 52,82 53,81 56,81 56.5,81.5 56.77,81.77 JP9.6
D4  (via drill 0.6)
  Top 0.305: v68.9,68.2 v68.9,62 | U$11.P$4 66.8,41 67.2,41 v67.3,41.1 | U11.2 v72.9,80
  Bottom 0.254: R41.2 77.7,57.8 78.5,58.6 78.5,61.2 78.5,61.4 78.1,61.8 77.9,61.8 77.6,61.8 75.9,63.5 75.8,63.6 75.7,63.7 75.4,64 70.1,64 69.7,63.6 68.9,62.8 v68.9,62
  Bottom 0.305: v68.9,68.2 68.9,75.7 72,78.8 72.9,79.7 v72.9,80 | v68.9,62 68.9,42.8 68.9,42.7 v67.3,41.1
D5  (via drill 0.6)
  Top 0.305: U11.9 71.71,70.21 70.4,68.9 70.1,68.6 70.1,65.7 v70.1,62 | U$11.P$2 66.9,40 v67.3,39.6
  Bottom 0.254: R40.2 77.18,61.32 75.75,62.75 | 75.75,62.75 75.6,62.9 | v70.1,62 70.1,62.6 70.4,62.9 70.5,63 70.8,63.3 75.2,63.3 75.5,63 75.75,62.75
  Bottom 0.305: v70.1,62 70.1,42.4 v67.3,39.6
D6  (via drill 0.6)
  Top 0.305: U11.10 72.49,69.59 71.4,68.5 71.3,68.4 v71.3,62 | v67.5,28.6 U$13.P$4
  Bottom 0.254: R45.2 71.5,17.3 71.2,17 71.2,14.6 70.1,13.5 67.1,13.5 65.6,15 65.5,15.1 65.5,24.4 67.5,26.4 v67.5,28.6
  Bottom 0.305: v71.3,62 71.3,40.5 67.5,36.7 67.5,28.7 v67.5,28.6
D7  (via drill 0.6)
  Top 0.305: U11.11 73.31,69.01 72.5,68.2 v72.5,62 | v69.1,27.6 U$13.P$2
  Bottom 0.254: R44.2 70.9,19.6 70.6,19.3 70.6,15 69.9,14.3 69.8,14.2 67.5,14.2 66.3,15.4 66.2,15.5 66.2,23.7 69.1,26.6 v69.1,27.6
  Bottom 0.305: v69.1,27.6 69.1,27.7 69.1,36.4 72.4,39.7 72.5,39.8 v72.5,62
D8  (via drill 0.6)
  Top 0.305: U11.12 74.09,68.09 73.8,67.8 73.7,67.7 v73.7,62 | v67.2,16.8 U$12.P$4
  Bottom 0.254: R43.2 70.4,21.9 69.9,21.4 69.9,15.3 69.5,14.9 68.3,14.9 67.9,15.3 67.7,15.5 67.7,16.3 v67.2,16.8
  Bottom 0.305: v73.7,62 73.7,39.5 70.4,36.2 70.4,26.6 67.2,23.4 v67.2,16.8
D9  (via drill 0.6)
  Top 0.305: U11.13 74.91,63.01 v74.9,62 | v68.9,15.8 U$12.P$2
  Bottom 0.254: R42.2 70,24.2 69.85,24.35
  Bottom 0.305: v74.9,62 74.9,39.2 71.6,35.9 71.6,26.1 69.85,24.35 68.4,22.9 68.4,16.3 v68.9,15.8
D10
  Top 0.406: U11.14 75.69,66.91 78.4,64.2 87.5,64.2 88.5,65.2 U7.P$1
DTR
  Top 0.254: IC1.55 40.25,69.75 41.5,68.5 41.5,64 42,63.5 C36.1
  Top 0.406: C36.1 44.6,62.9 45.5,62 46,61.5 46,59.5 46.5,59 49,59 49.5,58.5 49.5,55.15 JP6.6
EECLK_A
  Top 0.254: IC1.62 40.25,73.25 42,71.5 42.5,71 42.5,70.5 43,70 43.5,69.5 44.3,69.5 U2.4
  Top 0.406: U2.4 44.58,69.42 R17.2
EECLK_B
  Top 0.254: IC2.62 61.35,175.75 61.4,175.7 62.4,174.7 62.4,173.2 63.01,172.59 U10.4 65.58,172.27 R49.2
EECS_A
  Top 0.254: IC1.63 40.75,73.75 43.5,71 44.27,71 U2.3
  Top 0.406: U2.3 45.87,70.86 46,71 46.5,71.5 46.5,74 46,74.5 45,75.5 44.5,76 44.5,76.42 R16.2
EECS_B
  Top 0.254: IC2.63 60.25,176.25 60.6,176.6 60.6,178.7 60.9,179 R48.2
  Top 0.406: R48.2 65.3,179 63.8,177.5 63.8,174.4 64.3,173.9 65.86,173.9 U10.3
EEDATA_A
  Top 0.254: IC1.61 39.75,72.75 41.5,71 41.5,70.5 42,70 43,69 43,65.5 43.5,65 49,65 49.5,65.5 49.5,67.5 49,68 48,68 47.5,68.5 47.5,70 48,70.5 48.37,70.86 U2.6
  Top 0.406: U2.6 52.56,70.86 R15.1
EEDATA_B
  Top 0.254: IC2.61 60.85,175.25 61.7,174.4 61.7,171.9 63.2,170.4 63.2,168.8 64,168 66.5,168 67,168.5 67,171.1 69.7,173.8 69.77,173.87 U10.6
  Top 0.406: R47.1 74.42,175.42 72.9,173.9 71.14,173.9 U10.6
GND_A  (via drill 0.3, 0.6)
  Top 0.152: C9.1 29.21,84.55 34.29,84.55 R8.1 | v35.56,83.28 35.56,84.42 | 35.56,84.42 35.56,84.55 35.56,84.42 | 108,82.01 107.95,82.01 108.18,81.78
  Top 0.254: IC1.10 32.25,74.75 | 32.25,74.75 32.5,74.5 34.5,74.5 34.75,74.75 | 34.75,74.75 IC1.5 34.75,74.75 | 34.75,74.75 35,74.5 36.5,74.5 36.75,74.75 IC1.1 | JP6.1 34.5,53.15 34.5,53.5 33.5,54.5 33,55 33,60.5 34,61.5 34.5,62 36.25,63.75 IC1.47 36.25,66.75 36.2,66.8 35.6,67.4 | U3.14 99.26,88.21 99,88.47 | U3.17 98.25,88.27 U3.12 98.25,82.75 98,82.5 97.1,81.6 C13.1 | IC1.15 29.75,74.65 v29.9,74.5 30.4,74.5 30.75,74.85 IC1.13 30.75,74.75 31,74.5 31.4,74.5 31.5,74.5 31.6,74.5 31.75,74.65 IC1.11 31.75,74.55 31.8,74.5 32,74.5 32.25,74.75 | IC1.25 29.05,70.25 29.25,70.25 29.3,70.3 v29.3,70.8 | IC1.35 30.25,66.05 | 30.25,66.05 31.5,67.3 31.6,67.4 v35.5,67.4 | v35.5,67.4 35.6,67.4 | IC1.51 37.65,67.75 37.4,68 37.1,68.3 37,68.4 v37,69 | v35.5,67.4 35.6,67.4 | 30.25,66.05 23.55,66.05 22.7,66.9 U6.4 | R57.1 69.8,89.6 68.8,88.6 65.5,88.6 64.8,89.3 | 64.8,90.02 R56.1 64.8,90.12 64.8,89.3 | R55.1 59.68,89.72 | R55.1 59.68,89.32 60.2,88.8 64.3,88.8 64.8,89.3 | R55.1 60.8,90.2 61.2,90.6 61.2,91.3 61.6,91.7 62,91.7 62.8,92.5 65.2,92.5 65.8,93.1 v65.8,95.1 67.28,93.62 R54.1
  Top 0.406: C3.1 36.8,100.4 C4.1 32.92,98.67 U1.15 29.18,98.67 29,98.5 28,97.5 28,92 28.5,91.5 28.95,91.06 | U1.9 28.95,91.06 | 28.95,91.06 28.55,91.06 27.75,90.25 26,88.5 23.5,86 23,85.5 22.91,85.41 U4.4 v21.1,87.2 | 50,87.5 C6.1 49.9,89.1 49.5,89.5 47.5,91.5 | 49.1,82 C5.1 48.8,82.3 U$2.P$2 | R51.2 47.42,91.58 47.5,91.5 | R50.2 54.23,91.69 JP9.1 53.54,88.04 | C7.1 C8.1 37.5,53.31 JP6.2 JP6.1 29.5,53 C18.1 | R8.1 35.56,84.42 37.48,84.42 C10.1 37.8,84.7 | U$2.P$4 39,87 39,88.5 40,89.5 40.5,90 41,90.5 46.5,90.5 47.5,91.5 | 47.5,91.5 47.5,92.5 | 61.4,70.5 C37.1 | 89.08,80.48 C17.1 | U11.5 69.41,77.59 69,78 69,79 69.19,79.19 | 69.19,79.19 U11.3 71.81,79.19 71.91,79.19 72.7,78.4 U11.21 81.29,78.41 C39.2 | U$7.P$4 67,73.9 67,73.5 67,73 | v68,79 68.19,79.19 69.19,79.19 | R14.2 106.42,80 | 106.42,77.52 C19.1 | 106.4,74.71 106.09,74.41 F2.P$2 | U5.4 v21.1,78.2 | U6.4 v21.1,68.7 | JP8.1 57.51,51.59 58.1,51 62.3,51 62.8,51.5 C29.1 62.02,53.38 U9.P$3 | R18.2 87.3,75.72 87.3,71 89.2,69.1 91.04,67.26 U7.P$2 91.04,65.34 91,65.3 83.5,57.8 v82.2,57.8
  Top 0.61: C11.P$2 75.5,99 75.25,99.25 | U2.7 57.16,72.14 57.2,72.1 57.2,71.7 57.2,71.4 58.1,70.5 | 61.4,70.5 C37.1 63.5,70.6 U$7.P$2 | 64.6,70.6 64.6,71.1 64.6,71.3 65.2,71.9 66.9,71.9 v67,72 67,73.7 U$7.P$4 67.3,73.4 C38.1 | 67,73.5 67,73.8 66.7,74.1
  Top 0.813: 106.42,80 108,81.58 108,82.01 108,87.5 108,88 107.53,88.47 107.03,88.47 99,88.47 U3.17 98.42,88.5 97,88.5 96.5,88 93.55,85.05 | C13.1 C12.1 96,77.5 94,75.5 90.5,75.5 89.08,76.92 R18.2 89.1,77.52 C17.1 89.1,80.6 91.9,83.4 | 106.42,77.52 C19.1 | 106.4,74.71 106.09,74.41 | R23.2 92,83.5 93.55,85.05 | 106,73.4 108.12,71.28 R24.1 R11.1 | v82.4,80.5 81.9,80 C39.2 | v80.1,81.7 v80.1,84.2 | v93.6,83.1 93.6,85 93.55,85.05
  Top 1.016: C19.1 106.4,77 | 106.4,77 106.4,73.5 106.3,73.4 106,73.4 104.6,73.4 104.4,73.2 104.59,73.2 F2.P$2 | 106.42,80 106.42,77.02 106.4,77 | 87.5,100.2 C20.P$2 75.6,100.2 C11.P$2 | 87.5,100.2 87.7,100.2 v88.7,101.2 | v108.5,90.2 108.5,82.1 108.18,81.78 106.5,80.1 | C14.1 89.1,98.6 87.5,100.2 | 50,87.5 51.8,87.5 | 51.8,87.5 53.69,87.5 JP9.1 | 51.8,82 51.8,81.8 53.6,80 54.2,79.4 56.1,79.4 57.2,78.3 57.2,71.7 | 51.8,82 51.8,87.5 | C5.1 51.7,82.1 51.8,82 | 51.8,82 50.8,82 v48.6,79.8 | 57.2,71.7 57.2,72.1 | SW1.P$4 SW1.P$1 74.65,99.25 | 57.2,71.7 58.3,70.6 C40.2 59.2,70.5 61.4,70.5
  Bottom 0.152: v35.56,83.28 40.64,78.2 40.77,78.07
  Bottom 0.254: v29.9,74.5 30.2,74.5 | v37,69 37,68.9
  Bottom 0.406: v67,72 67.5,72.5 67.5,77 67.5,78.5 v68,79 | v21.1,87.2 v21.1,78.2 21.1,77.7 v21.1,68.7 | 29.3,70.4 v29.3,70.8 | 37,68.9 v35.5,67.4 | v65.8,95.1 65.8,97.2 63.95,99.05 SW1.P$1 | R41.1 v82.2,57.8 81.4,57 81.4,35.2 75.2,29 75.2,22.5 75.2,22.1 | R45.1 75.4,17.3 75.2,17.5 75.2,22.1 | R43.1 75.4,21.9 75.2,22.1
  Bottom 0.813: v21.1,68.7 24.2,68.7 23,68.7 | 23,68.7 23.2,68.5 23.3,68.5 23.1,68.7 23,68.7 | 23,68.7 23.9,68.7 | 23.9,68.7 23.7,68.5 23.7,68.4 23.9,68.6 23.9,68.7 | 23.9,68.7 23.8,68.7 | 23.8,68.7 27.7,68.7 29.3,70.3 29.3,70.4 v29.3,70.8 29.3,73.9 v29.9,74.5 30.2,74.5 38.8,74.5 39.7,75.4 39.7,77 40.77,78.07 41.3,78.6 47.4,78.6 v48.6,79.8 | 23.5,68.1 23.5,68.4 23.8,68.7 | JP10.6 79.73,76.23 79.73,77.83 v82.4,80.5 81.3,80.5 v80.1,81.7 | v80.1,84.2 80.1,84.6 83.3,87.8 87.8,87.8 88.6,87 88.6,83 90.05,81.55 92.05,81.55 v93.6,83.1
  Bottom 1.016: JP8.1 53.19,51.59 52,50.4 30.2,50.4 23.5,57.1 23.5,68.1 | v88.7,101.2 91.2,101.2 106.8,101.2 108.5,99.5 v108.5,90.2 | JP9.1 54.23,91.3 52.9,92.63 52.9,100.3 53.9,101.3 56.7,101.3 57.25,100.75 57.45,100.55 SW1.P$4
  pour Top: -11.8,99.2 -9.8,99.2 -4.6,104.4 111.4,104.4 116.4,99.4 116.4,3.1 112.3,-1 -3.5,-1 -11.1,6.6 -11.1,96.8 -11.9,97.6 -11.9,98.1
  pour Bottom: -16.9,99.1 -16.9,99.8 -12.3,104.4 114.5,104.4 120.6,98.3 120.6,3.6 112.4,-4.6 -4,-4.6 -18.4,9.8 -18.4,92.2 -17.6,93
GND_B  (via drill 0.6)
  Top 0.152: 50.75,168.37 50.8,168.37 50.75,168.37
  Top 0.254: U18.14 53.34,158.76 U18.17 52.73,157.75 U18.12 52.55,157.75 52.5,157.7 | IC2.51 57.15,170.25 57.1,170.2 56.75,169.85 IC2.47 56.75,165.85 57.4,165.2 60.1,165.2 60.8,164.5 60.8,163.62 R67.2 | 32,165.9 33.6,164.3 | IC2.25 49.35,172.75 50.7,172.75 50.75,172.8 | IC2.35 50.75,168.37 50.75,168.8 50.75,172.8 | 50.75,172.8 50.75,173.05 50.75,176.95 50.6,177.1 | IC2.15 50.25,177.45 50.6,177.1 | 50.6,177.1 51.3,177.1 | 51.3,177.1 52.3,177.1 | 52.3,177.1 52.8,177.1 | 55.3,177.1 56.9,177.1 57.2,177.4 57.25,177.45 IC2.1 | IC2.5 55.25,177.15 55.3,177.1 | IC2.10 52.75,177.15 52.8,177.1 | IC2.11 52.25,177.15 52.3,177.1 | IC2.13 51.25,177.15 51.3,177.1 | 52.8,177.1 52.9,177 52.9,176.4 53.1,176.2 55,176.2 55.2,176.4 55.2,177 55.3,177.1
  Top 0.406: U13.4 19.91,190.91 v19.6,190.6 | 19.6,182 v19.6,182.4 19.6,182 | 19.6,182 20.6,181 U14.4 20.59,181 19.6,182 | v19.6,172.7 19.6,172.2 20.5,171.3 U15.4 | U12.4 33.9,176.5 v33.1,176.5 | C30.1 45.02,185.42 R35.1 | R35.1 C31.1 | R35.1 49.02,185.4 C34.1 | U8.9 81.45,189.44 82.4,188.5 82.4,182.8 81.4,181.8 80.33,181.8 U8.15 77.58,181.82 C24.1 76.8,182.4 C23.1 73.4,179 | U10.7 72.33,175.13 72.9,175.7 72.9,178.5 73.4,179 | 52.6,157 52.6,156.9 52.5,156.8 52.5,151.9 52.5,151.6 53.1,150.4 60,150.4 60,150.5 53.5,150.5 53.3,150.3 52.6,151 52.6,151.2 53.1,150.7 | 53.1,150.7 53.5,150.7 52.5,151.7 52.5,152.2 52.5,150.1 53.1,150.7 | 53.1,150.7 53.7,150.7 60.62,150.7 | C34.1 C35.1 59.8,187.7 U$6.P$4 61.8,189.7 C26.1 | U$6.P$2 66.2,182.8 C25.1 69.9,182.5 73.4,179 | C34.1 v43.2,185.4 | v43.6,168.4 48.9,168.4 49.3,168.8 50.75,168.8
  Top 0.61: 52.5,157.7 52.5,157.3 52.7,157.1 52.6,157 | 33.6,164.3 v33.6,162.9 | v36,150 37.7,148.3 49.9,148.3 | R70.2 60.82,150.9 60.62,150.7 59.92,150 51.7,150 52.1,150 52.1,150.5 52.5,150.9 51.4,149.8 51.6,150 50.25,148.65 | C61.1 66.5,160 65.7,160.8 | 50.25,148.65 50,148.4 49.9,148.3 | 49.9,148.3 50.25,148.65
  Top 0.813: R67.2 60.82,160.82 C56.1 | R70.2 60.8,152.52 C60.1 60.82,155.42 R68.2 60.82,158.38 60.8,158.4 | C56.1 65.7,160.8 | 65.7,160.8 65.9,160.8 | 65.9,160.8 66.5,161.4 | 66.5,161.4 C55.1 | C56.1 65.7,160.8 | 65.7,160.8 65.9,160.8 | 65.9,160.8 66.5,161.4 | 60.8,158.4 60.8,158.2 | 35.8,161.9 C57.1 33.6,164.3 32,165.9 31.8,165.9 28.9,165.9 25.7,162.7 25.7,162.39 F4.P$2 | 60.8,158.4 60.8,157.1 63,154.9 64.7,154.9 65.6,155.8 65.6,157.8 C61.1
  Bottom 0.152: 31.75,177.26 31.75,177.3
  Bottom 0.406: v33.1,176.5 32.3,177.3 31.75,177.3 28.7,177.3 24.1,172.7 v19.6,172.7 v19.6,182.4 v19.6,190.6 20.1,191.1 39.9,191.1 43.2,187.8 v43.2,185.4 | 31.75,177.26 34.74,177.26 v43.6,168.4
  Bottom 0.61: v19.6,190.6 17.5,190.6 15.9,189 15.9,165.4 18.4,162.9 v33.6,162.9 36,160.5 v36,150
  pour Bottom: -7.7,109.7 -7.7,108.1 -5.5,105.9 113.3,105.9 119.6,112.2 119.6,192.3 109.8,202.1 1.1,202.1 -7.9,193.1 -7.9,112.3 -7.8,112.2
  pour Top: -12.3,113.4 -12.3,110.8 -7.4,105.9 115.3,105.9 122.7,113.3 122.7,193.1 106.5,209.3 3.8,209.3 -15,190.5 -15,123.7 -17.4,121.3
IND+
  Top 0.406: U$1.D+ 11,96 12,95 12,93 13.5,91.5 R6.2
IND+_B
  Top 0.406: R31.2 97.3,188.5 98.5,187.3 98.5,185.1 99.1,184.5 U$5.D+
IND-
  Top 0.406: U$1.D- 11.78,96.8 R5.2
IND-_B
  Top 0.406: R30.2 96.42,185.48 98.2,183.7 U$5.D-
MISO
  Top 0.406: JP10.1 82.04,66.46 81,67.5 81,73 80,74 77.41,74 U11.16
MOSI
  Top 0.406: U11.15 76.51,69.99 77.5,69 JP10.4
N$1
  Top 0.254: 51.1,25.7 51.2,25.7 52.5,27 52.4,27.1 52.5,27.1
  Top 1.016: U$20.P$1 U$20.P$2 | U$20.P$2 50.3,23.1 | 50.3,23.1 50.3,25.9 | 50.3,25.9 51.1,25.1 51.2,25.2 51.9,25.2 51.9,25.4 51.4,25.9 52.1,25.9 50.3,25.9 | 50.3,25.9 50.5,25.7 51.1,25.7 | 52.5,27.1 52.7,27.1 50.3,23.1 | 50.3,23.1 49.6,23.1 48.5,23.1 48.5,25.9 | 48.5,25.9 49.2,23.8 49.8,23.9 48.5,25.9 | 48.5,25.9 50.4,25.9 49.6,25.1 49.6,25.9 50.2,25.9 51.7,24.5 52.7,24.5 | 52.7,24.5 51.2,24.5 51,24.3 50.4,23.7 50.4,23.5 50.34,23.16 U$20.P$3 | U$20.P$2 U$26.P$3 U$26.P$2 52.8,25.7 52.6,25.9 51.5,25.9 51.6,25.8 51.8,25.8 51.9,25.9 51.9,26 52.4,26.5 52.4,27.1 52.5,27.1 | 52.5,27.1 53.9,27.1 54.2,27.1 54.2,24.5 52.7,24.5 | 52.7,24.5 53.5,25 53.2,26.7 U$26.P$1
N$2
  Top 0.254: 50.5,29.2 51.7,30.4 | 51.23,31.73 51.39,31.73 U$27.P$1
  Top 1.016: U$21.P$1 U$21.P$2 U$21.P$3 51.23,31.73 | 52.5,33 54.1,33 54.1,30.4 | 54.1,30.4 53.3,32.4 53.2,30.7 54.1,30.4 | 54.1,30.4 51.4,30.4 50.5,29.5 50.5,29.2 | 50.5,29.2 50.8,29.5 50.8,30.4 51.7,30.4 | 50.5,29.2 50.7,31.8 49.6,31.8 49.5,31 50.2,31.8 48.6,31.8 49.1,29.8 49.8,29.7 48.5,31.8 48.5,29.2 50.3,29.2 50.3,31.8 53.1,31.8 53.1,32.8 52.9,33 52.9,32.9 51.8,31.8 52.3,31.8 53,32.5 53,32.6 52.6,33 52.4,33 52.4,31.7 52.6,31.5 51.4,31.8 51.5,31.7 51.7,31.7 52,31.4 52,31.1 52.1,31 51.2,31 51,31.2 51,30.6 51.1,30.5 U$27.P$2 | U$27.P$2 U$27.P$3 | U$27.P$2 U$27.P$1
N$3  (via drill 0.5, 0.6)
  Top 0.254: U$20.P$4 50.41,27.11 51.2,27.9 51.5,28.2 53.7,28.2 55,28.2 55.6,27.6 v55.6,26.2 55.6,23.6 55.3,23.3 53.5,23.3 U$26.P$4 53.51,23.3 | v61.5,26.2 61.16,26.54 61.16,27.05 U$13.P$10
  Bottom 0.254: v61.5,26.2 v55.6,26.2
N$4  (via drill 0.5, 0.6)
  Top 0.254: U$21.P$4 51.23,33.9 51.53,34.2 55,34.2 55.3,33.9 55.6,33.6 v55.6,30 55.6,29.5 55.3,29.2 53.4,29.2 U$27.P$4 | v61.5,30 61.16,29.66 61.16,29.15 U$13.P$6
  Bottom 0.254: v61.5,30 v55.6,30
N$5
  Top 0.254: U18.4 42.75,158.25 42.2,157.7 36.9,157.7 36.2,158.4 | U18.5 43.05,157.75 42.4,157.1 37.2,157.1 36.2,158.1 36.2,158.5 36.4,158.7 36.5,158.8 36.5,157.9 36.6,157.8 36.4,157.8 36.4,158 36.2,158.2 36,158.4 36,158.2 35.8,158.2 | 35.8,158.2 35.8,158.1 | 35.8,158.1 36.8,157.1 37.4,157.1 36.6,157.1 35.8,157.9 35.8,158.1 | 35.8,158.1 35.9,158.2 35.9,158.3 35.9,158.7 35.8,158.8 35.8,158.2 | 35.8,158.2 36.9,157.1 42.6,157.1 43.2,157.7 50.8,157.7 50.8,158.1 50.7,158.2 50.7,157.9 43,157.9 | 43,157.9 50.4,157.9 50.6,158.1 42.8,158.1 42.3,157.6 36.8,157.6 37,157.6 37.3,157.3 42.5,157.3 43,157.8 43,157.9 | 43,157.9 42.9,158 42.4,157.5 37.2,157.5 37.1,157.4 36.9,157.4 36.3,158 36.2,158.4 | 36.2,158.4 36.2,158.9 C57.2
  Top 0.813: F3.P$2 30.5,163 34.4,159.1 C57.2
N$6
  Top 0.254: D5.2 46.9,159.7 47.8,158.8 47.84,158.76 U18.3
  Top 0.61: C58.1 43.53,159.87 43.93,159.87 44.5,159.3 46.43,159.3 D5.2
  Top 0.813: C58.1 41.7,160 40.9,159.2 39.65,159.2 L5.2
N$7
  Top 0.61: 30.21,158.9 F3.P$1 30.11,159 24.2,159 23.9,159.3 D10.2
  Top 1.016: D9.2 F3.P$1
N$8
  Top 0.813: LED6.C R32.2
N$9
  Top 0.254: R54.2 73,93.2 73.5,92.7 74,92.2 80.3,92.2 81.2,91.3 LED8.C
N$10
  Top 0.813: R62.1 LED14.C
N$11
  Top 0.813: R33.2 LED7.C
N$12
  Top 1.016: U$18.P$1 49.6,11.49 49.6,11.5 48.4,11.5 48.4,14.1 49.2,14.1 49.8,13.5 49.1,13.5 49,13.4 49,12.4 49.6,12.4 49.8,12.2 49.8,12.7 49.5,13 49.5,13.2 48.6,14.1 49.6,14.1 51.2,14.1 U$18.P$2 U$18.P$3 51.63,14.04 52.9,15.3 52.7,15.3 54.2,15.3 | 54.2,15.3 53.3,14.9 53.6,13.3 52.8,12.7 54.2,12.7 54.2,15.3 | 54.2,15.3 52.7,12.7 51.4,12.7 50.2,11.5 50.3,11.5 50.3,14.1 51.6,14.1 52.2,13.5 51.2,13.5 51,13.3 51,12.9 U$24.P$2 | U$24.P$2 U$24.P$1 | U$24.P$2 U$24.P$3
N$13
  Top 1.016: U$19.P$1 U$19.P$2 U$19.P$3 51.63,19.84 52.9,21.1 | 52.9,21.1 52.7,18.5 54.2,18.5 54.2,21.1 52.7,21.1 52.9,21.1 | 52.9,21.1 53.6,20.4 53.4,19 52.9,18.5 51.4,18.5 50.2,17.3 | 50.2,17.3 49.6,17.3 48.4,17.3 48.4,19.9 49.9,19.9 49.9,18 49.1,18 49.2,19.4 49.6,19.8 49.6,19.9 51.7,19.9 50.2,17.3 | 50.2,17.3 50.3,19.8 51.6,19.8 52.1,19.3 51.3,19.3 51.1,19.1 51.1,18.8 U$25.P$2 | U$25.P$2 U$25.P$3 | U$25.P$2 U$25.P$1
N$14  (via drill 0.5, 0.6)
  Top 0.254: U$18.P$4 50.34,15.44 50.9,16 51,16.1 51.2,16.3 53.8,16.3 55,16.3 55.6,15.7 v55.6,14.4 55.6,12 55.1,11.5 53.6,11.5 U$24.P$4 53.6,11.49 | v61.5,14.4 61.16,14.74 61.16,15.25 U$12.P$10
  Bottom 0.254: v61.5,14.4 55.8,14.4 v55.6,14.4
N$15  (via drill 0.5, 0.6)
  Top 0.254: U$19.P$4 51.13,21.9 51.34,22.1 55,22.1 55.2,21.9 55.6,21.5 v55.6,18.2 55.6,17.7 55.2,17.3 53.49,17.3 U$25.P$4 | v61.5,18.2 61.16,17.86 61.16,17.35 U$12.P$6
  Bottom 0.254: v61.5,18.2 v55.6,18.2
N$16
  Top 0.254: U18.6 48.81,157.24 47.1,155.53 D6.2
  Top 0.813: L6.1 42.45,155.55 C59.1 43.9,154.7 44.7,155.5 47.03,155.5 D6.2
N$17
  Top 0.254: 46.2,134.4 44.8,133 | 44.8,130.5 46.3,132 | 46.3,132 46.4,132.1 46.3,132
  Top 0.813: U$9.P$1 U$9.P$2 U$9.P$3 45.44,133.03 44,130.5 | 44,130.5 44.8,130.5 | 44.8,130.5 44.8,131.3 45,131.5 45.9,131.9 44.8,130.8 44.8,130.5 | 44.8,130.5 44.6,130.5 44.8,130.5 | 46.3,132 46.3,132.2 46.5,132.4 46.5,133.9 45.6,133 44.8,133 | 46.2,134.4 46.8,134.4 46.9,134.4 46.2,134.4 | 46.2,134.4 46.2,134 45.2,133 44.1,133 44,133.1 | 44,133.1 45.6,133.1 45.7,133.2 46.3,133.2 46.6,133.5 46.9,131.7 46.8,131.7 45.3,131.7 44.1,130.5 44,130.5 | 44,130.5 44,133.1 | 44,133.1 44,132.7 44.4,132.3 44.4,131.6 44.6,131.4 44.6,131.9 45,132.3 45,132.4 44.8,132.6 45.4,132.6 45.7,132.3 U$14.P$2 | U$14.P$2 U$14.P$1 | U$14.P$3 U$14.P$2
N$18
  Top 0.254: U18.11 55.94,157.24 56.8,158.1 R68.1
N$19
  Top 0.254: 51.3,37.9 51.45,37.9 U$22.P$1 | 50.4,35.3 50.59,35.3 51.8,36.5
  Top 1.016: U$16.P$1 50.4,35.3 | 51.9,36.8 52.4,36.8 52.7,36.5 53.8,36.5 53.2,36.5 54.1,36.5 54.1,39.1 53.8,39.1 52.6,39.1 52.5,39.1 | 52.5,39.1 52.3,39.1 52.3,38.4 52.4,38.3 52.5,38.6 51.8,37.9 51.1,37.9 50.5,37.3 50.3,37.3 52.7,37.3 53.2,37.8 53.2,38.7 53.1,37 52.8,36.5 51.8,36.5 51.5,36.5 50.3,35.3 50.3,37.9 49.6,37.9 49.8,37.5 49.2,37.5 49.3,36.1 49.7,36 50.6,37.9 48.5,37.9 48.5,35.3 49.6,35.3 49.6,35.4 49.7,35.3 50.4,35.3 50.4,37.6 50.1,37.9 51.3,37.9 | 52.5,39.1 52.7,39.1 52.7,37 52.3,36.6 52.3,36.9 52,37.2 51.2,37.2 U$16.P$2 U$16.P$3 U$22.P$2 | U$22.P$2 U$22.P$3 | U$22.P$2 U$22.P$1
N$20  (1 unrouted)
  Top 1.016: U$17.P$1 U$17.P$2 U$17.P$3 | 52.5,44.2 52.5,44.6 52.7,44.4 52.7,42.3 52.6,42.3 51.6,42.3 | 51.6,42.3 52.2,42.8 | 50.5,41.1 50.3,41.1 50.3,42.6 50.3,43.6 51.8,43.7 50.3,43.7 50.4,43.6 51.2,43.6 51.7,43.6 52.3,44.2 52.3,44.9 52.7,44.9 52.7,43.6 51.9,42.8 51.9,42.6 51.6,42.3 | 51.6,42.3 51.2,42.3 50.7,41.8 50.7,41.1 50.7,42.6 51.3,43.2 52.66,43.46 U$23.P$2 | U$23.P$2 U$23.P$3 | U$23.P$2 U$23.P$1
N$21  (via drill 0.5, 0.6)
  Top 0.254: 52.77,35.4 U$22.P$4 54.4,35.3 55.3,35.3 55.6,35.6 55.6,36.5 v55.6,38.2 55.7,38.3 55.7,39.8 55.4,40.1 51.2,40.1 50.34,39.24 U$16.P$4 | v61.6,38.7 61.4,38.7 61.1,39 U$11.P$10
  Bottom 0.254: v55.6,38.2 55.8,38.2 55.9,38.2 61.1,38.2 v61.6,38.7
N$22  (via drill 0.5, 0.6)
  Top 0.254: U$17.P$4 51.23,45.8 51.34,45.9 54.1,45.9 54.8,45.9 55.6,45.1 v55.6,42.1 55.6,41.6 55.09,41.09 53.2,41.09 U$23.P$4 | v61.6,42.4 61.16,41.96 61.16,41.55 U$11.P$6
  Bottom 0.254: v61.6,42.4 55.9,42.4 v55.6,42.1
N$23
  Top 0.254: LED9.C 79.1,91.4 78.9,91.6 73.5,91.6 73.4,91.7 | 73.4,91.7 73.3,91.8 | R55.2 62.5,90.12 62.5,90.7 62.6,90.7 63.7,91.8 73.3,91.8 | 73.3,91.8 73.4,91.7
N$24
  Top 0.254: LED10.C 77,90.8 76.8,91 68.7,91 67.9,90.2 R56.2
N$25
  Top 0.254: R57.2 72.27,89.45 LED11.C
N$26
  Top 0.254: U18.15 55.74,159.25 56.6,160.1 57.2,160.7 57.9,160.7 C56.2
N$28
  Top 0.254: U18.10 55.95,156.75 56.4,156.3 57.3,155.4 C60.2
N$29
  Top 0.406: C29.2 60.77,53.38 U9.P$2
N$31
  Top 0.254: U3.5 98.25,92.55 99.6,93.9 | 99.6,93.9 100.3,94.6 100.5,94.5 98.8,92.6 98.8,92.8 98.9,92.8 98.9,93 99.2,93 99.2,93.3 | U3.4 98.75,92.75 100,94 | 100,94 100.4,94 | 100.4,94 100.7,94.3 100.7,94.4 100.3,94.4 100.3,94.2 100.4,94.2 100.4,94 | 100.4,94 98.6,92.2 98.6,92.1 98.4,92.1 98.4,91.7 | 98.4,91.7 98.6,91.7 98.4,91.7 | 98.4,91.7 98.4,91.6 98.6,91.6 98.6,91.4 98.3,91.4 98.5,91.4 98.5,91.3 98.4,91.3 98.4,91.2 98.6,91.2 98.6,91.1 98.4,91.1 98.4,91 98.6,91 98.6,90.8 | 98.6,90.8 98.5,90.8 98.6,90.8 | 98.6,90.8 98.6,90.6 98.6,90.5 | 98.6,90.5 98.4,90.5 98.6,90.5 | 98.6,90.5 98.6,90.4 98.4,90.4 98.4,90.3 98.6,90.3 98.6,90.2 | 98.6,90.2 98.4,90.2 98.6,90.2 | 98.6,90.2 98.4,90.1 98.6,90.1 98.6,91.9 98.4,91.9 98.4,92.5 98.6,92.5 98.6,92.4 98.4,92.4 98.4,92.6 98.4,92.7 98.6,92.7 98.6,92.8 98.7,92.8 98.7,93 98.8,93 99,93.1 99,93.2 99.2,93.3 | 99.2,93.3 99.2,93.4 99.3,93.4 99.6,93.5 | 99.6,93.5 99.6,93.8 | 99.6,93.8 99.6,93.9 | 99.6,93.9 99.6,93.8 | 99.6,93.8 99.6,93.7 99.8,93.7 99.8,94.1 99.9,94 99.9,94.2 100,94.2 100,94.3 | 100,94.3 100.2,94.3 100,94.3 | 100,94.3 100,94 | 100,94 100,93.8 99.8,93.8 99.8,93.6 99.6,93.5 | 99.6,93.5 99.4,93.3 99.2,93.3
  Top 0.813: F1.P$2 86,93.5 87.5,95 90,95 92,97 | 92,97 92,97.4 C14.2 | 92,97 92,100.5 92.5,101 99,101 100.5,99.5 100.5,94.5
N$32
  Top 0.254: U18.9 54.68,154.26 R69.2
  Top 0.813: R69.2 56.98,153.5 R70.1
N$33
  Top 0.254: U18.16 54.68,161.74 R66.2
  Top 0.813: R66.2 56.88,162.5 R67.1
N$34
  Top 0.254: D1.2 101.5,96.03 101.5,94 101.5,93.5 101,93 100.2,93 99.26,92.06 U3.3
  Top 0.406: C15.1 105.9,91.25 L1.2
  Top 0.61: C15.1 107,94.5 108.5,96 108.5,99.5 108,100 104,100 103.47,99.47 103.37,99.37 D1.2
N$35
  Top 0.254: D5.1 47.67,162.4 U18.1
N$36  (via drill 0.5)
  Top 0.254: U18.2 49.35,159.25 v48.7,159.9 | v45,161 45,161.6 45,162.2 44.6,162.6 43.6,162.6 C58.2
  Bottom 0.254: v45,161 47.6,161 v48.7,159.9
N$37  (via drill 0.5)
  Top 0.254: U18.7 49.26,156.75 48.9,156.4 v48.9,155.4 | v45,152.6 44.3,151.9 C59.2
  Bottom 0.254: v45,152.6 46.6,152.6 46.9,152.6 48.9,154.6 v48.9,155.4
N$38
  Top 0.254: R21.2 43,60.5 41.5,62 41,62.5 41,68 40.25,68.75 IC1.53
N$39
  Top 0.254: D6.1 47.7,152.8
  Top 0.305: 47.7,152.8 48.7,152.8 49.5,153.6 49.5,154.4 50.3,155.2 50.3,156.23 | 50.3,156.23 U18.8 50.3,156.23
N$40
  Top 0.254: U3.6 97.74,94.34 C16.1
  Top 0.406: 90.5,93.5 L2.1 90.9,93.75 90.9,94 92.9,96 93.5,96.6 93.7,96.8 93.7,99.5 94.2,100 94.5,100 97.5,100 98.5,99 98.5,98.03 D2.2
  Top 0.61: 98.53,95.13 C16.1
  Top 0.813: 98.53,95.13 C16.1 98.63,95.23 D2.2
N$41
  Top 0.254: 44.8,138.8 46,140 | 46,140 46.1,140.1 46,140 | 44.9,141.4 46.1,142.6
  Top 0.813: U$10.P$1 U$10.P$2 U$10.P$3 45,140.2 45.8,141 46,141 45.2,140.2 44.6,140.2 44.8,140.4 46.4,140.4 46.3,140.5 46.3,142.1 45.1,140.9 44.5,140.9 44.4,140.8 44.4,139.3 45.1,140 46,140 | 46,140 46.9,140 | 46.9,140 46.9,142.6 46.2,142.6 | 46.2,142.6 46.5,142.3 46.5,141.7 46.2,141.4 45.2,141.4 46.2,142.4 46.2,142.6 | 46.2,142.6 46.1,142.6 | 44.9,141.4 44,141.4 44,138.8 44.8,138.8 | 44.8,138.8 44.6,139 44.6,139.2 45.2,139.8 44.8,139.4 44.8,138.8 | 46,140 46.8,140 46.9,140 | 46.9,140 46.86,140.04 U$15.P$2 | U$15.P$2 U$15.P$1 | U$15.P$2 U$15.P$3
N$42
  Top 0.254: U$8.P$10 45.34,135.6 U$9.P$4
  Top 0.406: U$9.P$4 42.91,134.31 42.2,133.6 42.2,130.1 43.3,129 45.37,129 U$14.P$4
N$43
  Top 0.254: 47.16,138.5 U$15.P$4
  Top 0.305: 47.16,138.5 47.16,137.65 U$8.P$6
  Top 0.406: U$10.P$4 44.04,143.14 44.8,143.9 47.6,143.9 48.6,142.9 48.6,139.5 47.8,138.7 46.95,138.7 U$15.P$4
N$44
  Top 0.406: LED4.C R25.2
N$45
  Top 0.406: R26.2 LED5.C
N$46
  Top 0.254: IC1.52 39.75,68.25 40.5,67.5 40.5,62 42,60.5 42,58.5 42.5,58 43,57.5 R20.2
N$47
  Top 0.254: IC1.48 36.75,63.25 36,62.5 34.5,61 R19.2
N$49
  Top 0.406: C21.2 96.5,182.9 95.6,183.8 95.5,183.9 90.16,183.9 U8.4 | U8.3 U8.4 | U8.5 U8.4
N$50
  Top 0.813: LED13.C R59.2
N$52
  Top 0.813: LED12.C R58.2
N$55
  Top 0.254: U3.15 99.75,80.66 C13.2
N$56  (via drill 0.6)
  Top 0.61: 84,83.3 84.13,83.43 84.37,83.43 D7.2 86,83.53 F1.P$1 | 84,83.3 87.4,83.3 87.4,86.2 84,86.2 84,83.3 | 84,83.3 86.7,83.3 87.1,83.7 87.1,84.5 87,84.6 84.5,84.6 84.4,84.7 84.4,85.6 84.3,85.7 84.3,84 84.5,83.8 86.6,83.8 86.8,84 86.8,84.1 86.7,84.2 84.6,84.2 84.5,84.1 v84,83.8
  Bottom 0.61: v84,83.8 84,84.5 84,83.3 87,83.3 87.4,83.3 87.4,86.2 84,86.2 84,83.6 84.1,83.6 84.4,83.9 86.9,83.9 87.1,83.7 87.1,84.3 87,84.4 84.4,84.4 84.3,84.3 84.3,84.8 87,84.8 87,85.3 84.2,85.3 84.2,85.8 84.3,85.9 86.9,85.9 87.1,85.7 85.53,83.8 D7.2
N$57
  Top 0.406: U7.P$3 91.87,72.27 JP7.2
N$60
  Top 0.254: U3.10 97.25,85.25 92.5,80.5 C17.2
N$61  (via drill 0.6)
  Top 0.254: 96.75,86.25 U3.9 95.63,85.2 v95.5,85.2 | R23.1 89.08,84.28 89.08,84.48 | v90.5,85.2 89.28,85.2 89.08,85.4
  Top 0.813: R23.1 89.08,84.28 89.08,85.4 R22.2
  Bottom 0.254: v90.5,85.2 94.7,85.2 v95.5,85.2
N$62
  Top 0.254: R13.2 102,83.5 100.5,85 100.25,85.25 U3.16
  Top 0.406: R14.1 R13.2
N$63
  Top 0.254: U3.1 100.25,91.25 100.5,91.5 101,92 103,92 104.5,93.5 104.5,96.5 D1.1
N$64
  Top 0.254: U3.2 99.75,91.75 100.5,92.5 101.5,92.5 102.5,93.5 102.5,93.9 C15.2
N$65
  Top 0.254: U3.7 97.25,91.75 95.5,93.5 95.5,94.9 C16.2
N$66
  Top 0.254: U3.8 96.75,91.25 96.5,91.5 95,93 94,94 94,96 D2.1
N$67
  Top 0.254: U3.11 97.74,84.74 93.5,80.5 93.5,78 93,77.5 R18.1
N$68
  Top 0.406: U1.8 20.86,91 22,91 23,92 23,97.5 21.82,98.67 U1.2 22.18,98.67 23,99.5 23,100.5 22.5,101 17.6,101 C1.1 C2.1 13.4,100.4 11.5,98.5 7.3,98.5 6.4,99.4 5.7,99.4 5,98.7 4.8,98.5 4.8,93.7 | 9.4,94.4 U$1.GND 8.3,94.4 7.5,93.6 6.5,92.6 5.5,92.6 5,93.1 4.8,93.3 4.8,93.7 | R1.1 2.08,89.72 1.58,89.72 1,90.3 1,92.8 1.9,93.7 4.8,93.7
N$69
  Top 0.406: U1.12 U1.13 U1.14 30.89,97.41 32.2,96.1 36.5,96.1 37,96.6 C3.2
N$70
  Top 0.406: U1.11 32.67,93.59 R3.1
N$71
  Top 0.406: C1.2 19.9,97.6 20,97.5 20.09,97.41 U1.3 U1.4 U1.5